# Altium schematic sheet Overview.SchDoc
size A4; CompanyName: QRTECH AB; Address1: SWEDEN; SheetNumber: 1; SheetTotal: 100; PageSetup: Record=PageOptions|CenterHorizontal=True|CenterVertical=True|PrintScale=0.97|XCorrection=1.00|YCorrection=1.00|PrintKind=0|BorderSize=5000000|LeftOffset=0|BottomOffset=0|Orientation=2|PaperLength=1000|PaperWidth=1000|Scale=100|PaperSource=7|PrintQuality=-4|MediaType=1|DitherType=10|PaperKind=A4|PrintScaleMode=1; Q_Sheet_Created_By: Förnamn Efternamn; Q_Sheet_Status: Draft
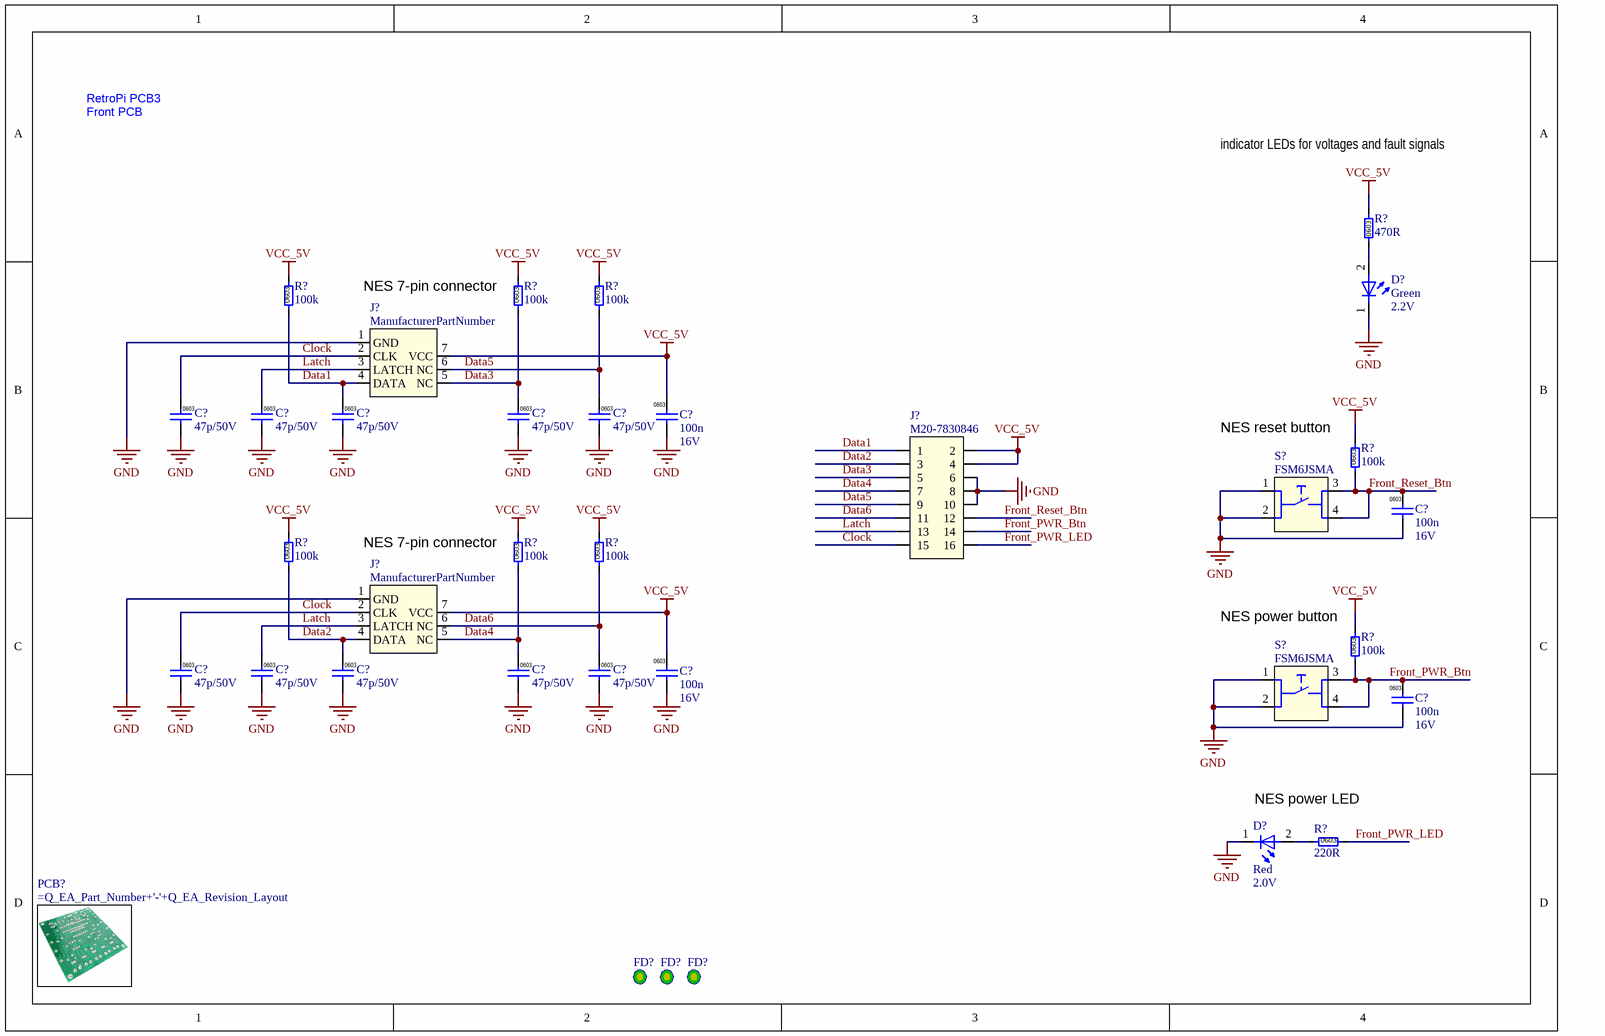
[diagram p0: Overview.SchDoc]

## Parts
(Parts that share a designator on the sheet are numbered #1, #2 ... from top to bottom, then left to right.)
C?#1  ValueVolatge: 47p/50V  [CAPC1608L[0603]]  (hidden comment: Capacitor_x1_p2-1)
C?#2  ValueVolatge: 47p/50V  [CAPC1608L[0603]]  (hidden comment: Capacitor_x1_p2-1)
C?#3  ValueVolatge: 47p/50V  [CAPC1608L[0603]]  (hidden comment: Capacitor_x1_p2-1)
C?#4  ValueVolatge: 47p/50V  [CAPC1608L[0603]]  (hidden comment: Capacitor_x1_p2-1)
C?#5  ValueVolatge: 47p/50V  [CAPC1608L[0603]]  (hidden comment: Capacitor_x1_p2-1)
C?#6  value 100n  Voltage: 16V  Package: 0603  [CAPC1608L[0603]]  (hidden comment: Capacitor_x1_p2-1)
C?#7  value 100n  Voltage: 16V  Package: 0603  [CAPC1608L[0603]]  (hidden comment: Capacitor_x1_p2-1)
C?#8  ValueVolatge: 47p/50V  [CAPC1608L[0603]]  (hidden comment: Capacitor_x1_p2-1)
C?#9  ValueVolatge: 47p/50V  [CAPC1608L[0603]]  (hidden comment: Capacitor_x1_p2-1)
C?#10  ValueVolatge: 47p/50V  [CAPC1608L[0603]]  (hidden comment: Capacitor_x1_p2-1)
C?#11  ValueVolatge: 47p/50V  [CAPC1608L[0603]]  (hidden comment: Capacitor_x1_p2-1)
C?#12  ValueVolatge: 47p/50V  [CAPC1608L[0603]]  (hidden comment: Capacitor_x1_p2-1)
C?#13  value 100n  Voltage: 16V  Package: 0603  [CAPC1608L[0603]]  (hidden comment: Capacitor_x1_p2-1)
C?#14  value 100n  Voltage: 16V  Package: 0603  [CAPC1608L[0603]]  (hidden comment: Capacitor_x1_p2-1)
D?#1  Color1: Green  VF: 2.2V  [LEDC1608N[0603]]  (hidden comment: Diode LED_x1_p2-1)
D?#2  Color1: Red  VF: 2.0V  [3mm LED THM RED]  (hidden comment: Diode LED_x1_p2-1)
FD?#1  PCB_FDC_x1_p0-1  [PCB_FDC100-A1]  (value not drawn)  (no BOM)
FD?#2  PCB_FDC_x1_p0-1  [PCB_FDC100-A1]  (value not drawn)  (no BOM)
FD?#3  PCB_FDC_x1_p0-1  [PCB_FDC100-A1]  (value not drawn)  (no BOM)
J?#1  NES_Connector  [NES_Connector]  (value not drawn)
J?#2  ManufacturerPartNumber: M20-7830846  [Harwin_M20-78308[Harwin M20-783, Header, 2.54x2.54, H 8.5, TH, Female, Vertical]]  (hidden comment: Connector_2x8_x1_p16-1)
J?#3  NES_Connector  [NES_Connector]  (value not drawn)
PCB?  PCB_x1_p0-1  (value not drawn)  (mechanical)
R?#1  value 470R  Package: 0603  [RESC1608L[0603]]  (hidden comment: Resistor_x1_p2-1)
R?#2  value 100k  [RESC1608L[0603]]  (hidden comment: Resistor_x1_p2-1)
R?#3  value 100k  [RESC1608L[0603]]  (hidden comment: Resistor_x1_p2-1)
R?#4  value 100k  [RESC1608L[0603]]  (hidden comment: Resistor_x1_p2-1)
R?#5  value 100k  [RESC1608L[0603]]  (hidden comment: Resistor_x1_p2-1)
R?#6  value 100k  [RESC1608L[0603]]  (hidden comment: Resistor_x1_p2-1)
R?#7  value 100k  [RESC1608L[0603]]  (hidden comment: Resistor_x1_p2-1)
R?#8  value 100k  [RESC1608L[0603]]  (hidden comment: Resistor_x1_p2-1)
R?#9  value 100k  [RESC1608L[0603]]  (hidden comment: Resistor_x1_p2-1)
R?#10  value 220R  [RESC1608L[0603]]  (hidden comment: Resistor_x1_p2-1)
S?#1  ManufacturerPartNumber: FSM6JSMA  [TE_FSM6JSMA]  (hidden comment: Switch, Push button, SPST_x1_p4-1[Off-(On)])
S?#2  ManufacturerPartNumber: FSM6JSMA  [TE_FSM6JSMA]  (hidden comment: Switch, Push button, SPST_x1_p4-1[Off-(On)])

## Nets
GND: C?#1.2 C?#2.2 C?#3.2 C?#4.2 C?#5.2 C?#6.1 C?#7.1 C?#8.2 C?#9.2 C?#10.2 C?#11.2 C?#12.2 C?#13.1 C?#14.1 D?#1.1(C) D?#2.1(C) J?#1.1(GND) J?#2.6 J?#2.8 J?#2.10 J?#3.1(GND) S?#1.1 S?#1.2 S?#2.1 S?#2.2
VCC_5V: C?#6.2 C?#13.2 J?#1.7(VCC) J?#2.2 J?#2.4 J?#3.7(VCC) R?#1.1 R?#2.2 R?#3.2 R?#4.2 R?#5.2 R?#6.2 R?#7.2 R?#8.2 R?#9.2
Clock: C?#1.1 C?#8.1 J?#1.2(CLK) J?#2.15 J?#3.2(CLK)
Data1: C?#3.1 J?#1.4(DATA) J?#2.1 R?#2.1
Data2: C?#10.1 J?#2.3 J?#3.4(DATA) R?#6.1
Data3: C?#4.1 J?#1.5(NC) J?#2.5 R?#3.1
Data4: C?#11.1 J?#2.7 J?#3.5(NC) R?#7.1
Data5: C?#5.1 J?#1.6(NC) J?#2.9 R?#4.1
Data6: C?#12.1 J?#2.11 J?#3.6(NC) R?#8.1
Front_PWR_Btn: C?#14.2 J?#2.14 R?#9.1 S?#2.3 S?#2.4
Front_PWR_LED: J?#2.16 R?#10.2
Front_Reset_Btn: C?#7.2 J?#2.12 R?#5.1 S?#1.3 S?#1.4
Latch: C?#2.1 C?#9.1 J?#1.3(LATCH) J?#2.13 J?#3.3(LATCH)
NetD?#1_2: D?#1.2(A) R?#1.2
NetD?#2_2: D?#2.2(A) R?#10.1

## Notes on the sheet
- RetroPi PCB3
- Front PCB
- indicator LEDs for voltages and fault signals
- (near R?#3) NES 7-pin connector
- (near R?#5) NES reset button
- (near R?#7) NES 7-pin connector
- (near R?#9) NES power button
- NES power LED

## Library data of the parts
C?#1-C?#5 C?#8-C?#12 = C1608C0G1H470J080AA: Manufacturer: TDK; Value: 47p; Dielectric: C0G, NP0; Tolerance: 5%; Voltage: 50V; Package: 0603; ManufacturerPartNumber: C1608C0G1H470J080AA; ComponentLink1Description: Datasheet; ComponentLink1URL: http://svn.qrtech.se/websvn/wsvn/Resources/datasheets/TDK_C_MLCC_50V_Commercial-Datasheet.pdf; Digi-Key: 445-1277-1-ND; Status: Preliminary; Modified time: 2014-02-25 19:51:49; Temperature: -55°C to 125°C
C?#6 C?#7 C?#13 C?#14 = 0603YC104KAT2A: Manufacturer: AVX; Dielectric: X7R; Tolerance: 10%; ManufacturerPartNumber: 0603YC104KAT2A; ComponentLink1Description: Datasheet; ComponentLink1URL: http://products.qrtech.se/websvn/wsvn/Resources/datasheets/AVX MLCC X7R-Datasheet.pdf; Digi-Key: 478-1239-1-ND; Status: Preliminary; Temperature: -55°C to 125°C; Modified time: 2013-09-10 08:36:47
D?#1 = LG Q971-KN-1: Manufacturer: Osram; Current: 0.020A; ManufacturerPartNumber: LG Q971-KN-1; ComponentLink1Description: Datasheet; ComponentLink1URL: http://products.qrtech.se/websvn/wsvn/Resources/datasheets/Osram LG_LO_LS_LY_Q971-Datasheet.pdf; Digi-Key: 475-1409-1-ND; Package: 0603 (1608 Metric); Status: Preliminary; Temperature: -30°C to 85°C; Modified time: 2013-09-10 15:42:38
D?#2 = TLHR4400: 3mm  Red LED; Manufacturer: Vishay; Current: 10mA; ManufacturerPartNumber: TLHR4400; ComponentLink1Description: Datasheet; ComponentLink1URL: http://products.qrtech.se/websvn/wsvn/Resources/datasheets/Vishay tlhg440-Datasheet.pdf; Digi-Key: 751-1127-ND; Package: 3mm LED THM; Status: Draft; Temperature: -40°C to 100°C
FD?#1-FD?#3 = Fiducial_Circular-1: PartNumber: EP10906; ManufacturerPartNumber: Fiducial_Circular-1; Status: Preliminary
J?#2 = M20-7830846: Header; PartNumber: EP10484; Manufacturer: Harwin; Active: Yes; Revised by: frwe; Current: 3A; Pins total: 16; Rows: 2; Pitch: 2.54; Mating Pin Length/Height: 8.5; DesignDriftSensitivity: Yes/No; ComponentLink1Description: Datasheet; ComponentLink1URL: http://svn.qrtech.se/websvn/wsvn/Resources/datasheets/Harwin_M20_783-Datasheet.pdf; Digi-Key: 952-1820-ND; Status: Preliminary; Created by: frwe; Created time: 2013-12-12 06:39:12; Modified time: 2014-09-16 09:57:18; Revised time: 2013-12-12 06:48:25; Mounting: Through Hole; Automotive: No; Temperature: -40°C to 105°C; Orientation: Vertical; Type: Female; Color: Black; Board-to-Board Vertical: Yes; Wire-to-Board: Yes
PCB? = PCB: ManufacturerPartNumber: PCB; PartNumber: EP10930; Status: Preliminary; Q_EA_DesignDefaultTemperature: =Q_EA_DesignDefaultTemperature; Q_EA_DesignDefaultVoltage: =Q_EA_DesignDefaultVoltage; BomComment: =Q_EA_Part_Number+'-'+Q_EA_Revision_Layout
R?#1 = RC0603FR-07470RL: Manufacturer: Yageo; Power: 0.1W; Tolerance: 1%; ManufacturerPartNumber: RC0603FR-07470RL; ComponentLink1Description: Datasheet; ComponentLink1URL: http://products.qrtech.se/websvn/wsvn/Resources/datasheets/Yageo RC0603-Datasheet.pdf; Digi-Key: 311-470HRCT-ND; Status: Preliminary; Temperature: -55°C to 155°C; Modified time: 2013-09-06 06:52:31
R?#2-R?#9 = RC0603FR-07100KL: RES 100K OHM 1/10W 1% 0603 SMD; Manufacturer: Yageo; Revised by: frwe; Power: 0.1W; Voltage: 50V; Package: 0603; ManufacturerPartNumber: RC0603FR-07100KL; ComponentLink1Description: Datasheet; ComponentLink1URL: http://products.qrtech.se/websvn/wsvn/Resources/datasheets/Yageo RC0603-Datasheet.pdf; Digi-Key: 311-100KHRTR-ND; Status: Preliminary; Created by: dejmic; Created time: 2013-12-16 12:47:24; Modified time: 2013-12-19 07:57:15; Revised time: 2013-12-19 07:57:15; Temperature: -55°C to 155°C; Tolerance: 1%
R?#10 = CRCW0603220RFKEA: Manufacturer: Vishay Dale; Revised by: frwe; Tolerance: 1%; Power: 0.1W; Voltage: 75V; ManufacturerPartNumber: CRCW0603220RFKEA; ComponentLink1Description: Datasheet; ComponentLink1URL: http://svn.qrtech.se/websvn/wsvn/Resources/datasheets/Vishay D_CRCW Chip Resistor.pdf; Digi-Key: 541-220HCT-ND; Package: 0603; Status: Preliminary; Created by: krihol; Created time: 2014-03-19 08:42:33; Modified time: 2014-05-19 12:41:55; Revised time: 2014-03-19 15:13:43; Temperature: -55°C to 155°C; Automotive: Yes
S?#1 S?#2 = FSM6JSMA: Micro Miniature Pushbutton Switch; Manufacturer: TE Connectivity; VAC: 24V; Current: 50mA; ComponentLink1Description: Datasheet; ComponentLink1URL: http://svn.qrtech.se/websvn/wsvn/Resources/datasheets/TE%20FSM-Datasheet.pdf; Digi-Key: 450-1133-ND; Status: Draft for review; Created by: emiedv; Created time: 2014-06-19 14:05:16; Modified time: 2014-06-19 14:23:51; Mounting: Surface Mount; Automotive: No; Temperature: -35°C to 85°C; VDC: 24V
J?#1 J?#3 = NES_Connector: ManufacturerPartNumber: ManufacturerPartNumber